# Altium schematic sheet PC5_AudioOutput.SchDoc
size A
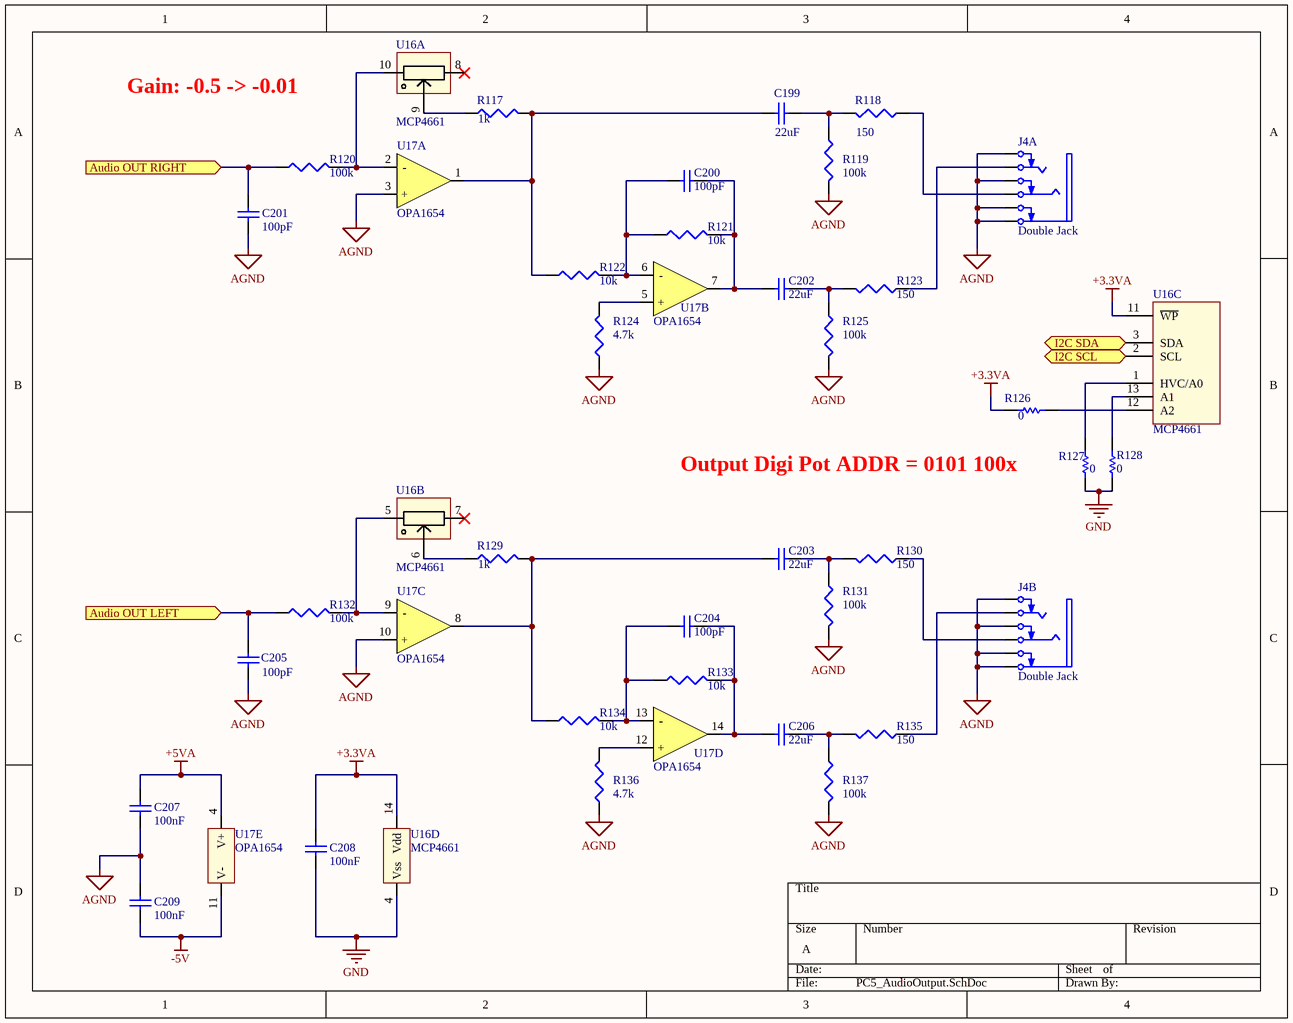
[diagram p0: PC5_AudioOutput.SchDoc]

## Parts
C199  value 22uF  [CAPC1608X08]  (hidden comment: Cap 22uF)
C200  value 100pF  [CAPC1608X08]  (hidden comment: Cap 100pF)
C201  value 100pF  [CAPC1608X08]  (hidden comment: Cap 100pF)
C202  value 22uF  [CAPC1608X08]  (hidden comment: Cap 22uF)
C203  value 22uF  [CAPC1608X08]  (hidden comment: Cap 22uF)
C204  value 100pF  [CAPC1608X08]  (hidden comment: Cap 100pF)
C205  value 100pF  [CAPC1608X08]  (hidden comment: Cap 100pF)
C206  value 22uF  [CAPC1608X08]  (hidden comment: Cap 22uF)
C207  value 100nF  [CAPC1608X08]  (hidden comment: Cap 100nF)
C208  value 100nF  [CAPC1608X08]  (hidden comment: Cap 100nF)
C209  value 100nF  [CAPC1608X08]  (hidden comment: Cap 100nF)
J4  Double Jack  [Amphenol_ACJS-MHDC]  (parts A,B of 2)
R117  value 1k  [RESC1608X05]  (hidden comment: Res 1k)
R118  value 150  [RESC1608X05]  (hidden comment: Cap 150)
R119  value 100k  [RESC1608X05]  (hidden comment: Res 100k)
R120  value 100k  [RESC1608X05]  (hidden comment: Res 100k)
R121  value 10k  [RESC1608X05]  (hidden comment: Res 10k)
R122  value 10k  [RESC1608X05]  (hidden comment: Res 10k)
R123  value 150  [RESC1608X05]  (hidden comment: Cap 150)
R124  value 4.7k  [RESC1608X05]  (hidden comment: Res 4.7k)
R125  value 100k  [RESC1608X05]  (hidden comment: Res 100k)
R126  value 0  [RESC1608X05]  (hidden comment: Res 0 Ohm)
R127  value 0  [RESC1608X05]  (hidden comment: Res 0 Ohm)
R128  value 0  [RESC1608X05]  (hidden comment: Res 0 Ohm)
R129  value 1k  [RESC1608X05]  (hidden comment: Res 1k)
R130  value 150  [RESC1608X05]  (hidden comment: Cap 150)
R131  value 100k  [RESC1608X05]  (hidden comment: Res 100k)
R132  value 100k  [RESC1608X05]  (hidden comment: Res 100k)
R133  value 10k  [RESC1608X05]  (hidden comment: Res 10k)
R134  value 10k  [RESC1608X05]  (hidden comment: Res 10k)
R135  value 150  [RESC1608X05]  (hidden comment: Cap 150)
R136  value 4.7k  [RESC1608X05]  (hidden comment: Res 4.7k)
R137  value 100k  [RESC1608X05]  (hidden comment: Res 100k)
U16  MCP4661  [TSSOP14_MC-M]  (parts A,B,C,D of 4)
U17  OPA1654  [D14-M]  (parts A,B,C,D,E of 5)

## Ports
Audio OUT LEFT (in), Audio OUT RIGHT (in), I2C SCL, I2C SDA

## Nets
+3.3VA: C208.1 R126.1 U16.11(~{WP}) U16.14(Vdd)
+5VA: C207.1 U17.4(V+)
-5V: C209.2 U17.11(V-)
AGND: C201.1 C205.1 C207.2 C209.1 J4.1(SB) J4.2(RB) J4.3(TB) J4.4(S) J4.7(SB) J4.8(RB) J4.9(TB) J4.10(S) R119.2 R124.1 R125.2 R131.2 R136.1 R137.2 U17.3(+) U17.10(+)
GND: C208.2 R127.1 R128.1 U16.4(Vss)
Audio OUT LEFT: C205.2 R132.1 ; port Audio OUT LEFT
Audio OUT RIGHT: C201.2 R120.1 ; port Audio OUT RIGHT
I2C SCL: U16.2(SCL) ; port I2C SCL
I2C SDA: U16.3(SDA) ; port I2C SDA
NetC199_1: C199.1 R118.2 R119.1
NetC199_2: C199.2 R117.2 R122.1 U17.1(OUT)
NetC200_1: C200.1 C202.2 R121.2 U17.7(OUT)
NetC200_2: C200.2 R121.1 R122.2 U17.6(-)
NetC202_1: C202.1 R123.2 R125.1
NetC203_1: C203.1 R130.2 R131.1
NetC203_2: C203.2 R129.2 R134.1 U17.8(OUT)
NetC204_1: C204.1 C206.2 R133.2 U17.14(OUT)
NetC204_2: C204.2 R133.1 R134.2 U17.13(-)
NetC206_1: C206.1 R135.2 R137.1
NetJ4_5: J4.5(R) R130.1
NetJ4_6: J4.6(T) R135.1
NetJ4_11: J4.11(R) R118.1
NetJ4_12: J4.12(T) R123.1
NetR117_1: R117.1 U16.9(P0W)
NetR120_2: R120.2 U16.10(P0B) U17.2(-)
NetR124_2: R124.2 U17.5(+)
NetR126_2: R126.2 U16.12(A2)
NetR127_2: R127.2 U16.1(HVC/A0)
NetR128_2: R128.2 U16.13(A1)
NetR129_1: R129.1 U16.6(P1W)
NetR132_2: R132.2 U16.5(P1B) U17.9(-)
NetR136_2: R136.2 U17.12(+)

Not connected (* = marked no-connect by the designer): U16 7(P1A)* 8(P0A)*

## Notes on the sheet
- Gain: -0.5 -> -0.01
- Output Digi Pot ADDR = 0101 100x

## Library data of the parts
C199 C202 C203 C206 = Cap Semi: Capacitor; Fabricant: MURATA; Fournisseur: Farnell; RefFabricant: GRM188R61A226ME15D; RefFournisseur: 2426957; Case: 0603 [1608 Metric]; DataSheet: http://www.farnell.com/datasheets/2047978.pdf
C200 C201 C204 C205 = Cap Semi: Capacitor; Fabricant: MULTICOMP; Fournisseur: Farnell; RefFabricant: MCMT18N101F250CT; RefFournisseur: 1856128; Case: 0603 [1608 Metric]; DataSheet: http://www.farnell.com/datasheets/1825496.pdf
C207-C209 = Cap Semi: Capacitor; Fabricant: KEMET; Fournisseur: Farnell; RefFabricant: C0603T104K5RALTU; RefFournisseur: 2522432; Case: 0603 [1608 Metric]
J4 = Dual TRS Jack Bypassed: Dual Jack stereo bypassed; Fabricant: AMPHENOL; Fournisseur: Farnell; RefFabricant: ACJS-MHDC; RefFournisseur: 2771861; DataSheet: http://www.farnell.com/datasheets/866888.pdf
R117 R129 = Res3: Resistor; Fabricant: TE CONNECTIVITY; Fournisseur: Farnell; RefFabricant: CRGH0603F1K0; RefFournisseur: 2332003; Case: 0603 [1608 Metric]; DataSheet: http://www.farnell.com/datasheets/2007183.pdf
R118 R123 R130 R135 = Res3: Capacitor; Fabricant: TE CONNECTIVITY; Fournisseur: Farnell; RefFabricant: CRGH0603J150R; RefFournisseur: 2331715; Case: 0603 [1608 Metric]
R119 R120 R125 R131 R132 R137 = Res3: Resistor; Fabricant: TE CONNECTIVITY; Fournisseur: Farnell; RefFabricant: RN73C1J100KBTDF; RefFournisseur: 2687850; Case: 0603 [1608 Metric]; DataSheet: http://www.farnell.com/datasheets/2189072.pdf
R121 R122 R133 R134 = Res3: Resistor; Fabricant: TE CONNECTIVITY; Fournisseur: Farnell; RefFabricant: CRGH0603J10K; RefFournisseur: 2331740; Case: 0603 [1608 Metric]; DataSheet: CRGH0603J10K
R124 R136 = Res3: Resistor; Fabricant: TE CONNECTIVITY; Fournisseur: Farnell; RefFabricant: CRGH0603J4K7; RefFournisseur: 2331736; Case: 0603 [1608 Metric]; DataSheet: http://www.farnell.com/datasheets/2007183.pdf
R126-R128 = Res1: Resistor; Fabricant: VISHAY; Fournisseur: Farnell; RefFabricant: CRCW06030000Z0EB; RefFournisseur: 2616741; Case: 0603 [1608 Metric]
U16 = MCP4661: Dual DigiPot non volatile I2C; RefFournisseur: 1840724; RefFabricant: MCP4661-503E/ST; Fournisseur: Farnell; Fabricant: MICROCHIP; DataSheet: http://www.farnell.com/datasheets/2243913.pdf
U17 = OPA1654: Quad Audio OpAmp; Fabricant: TEXAS INSTRUMENTS; RefFournisseur: 2099889; Fournisseur: Farnell; RefFabricant: OPA1654; DataSheet: http://www.ti.com/lit/ds/symlink/opa1654.pdf